# EAGLE design N64TinyUSB_HelveTiny_1.0 (EAGLE 7.7.0)

## Sheet 1 of 2
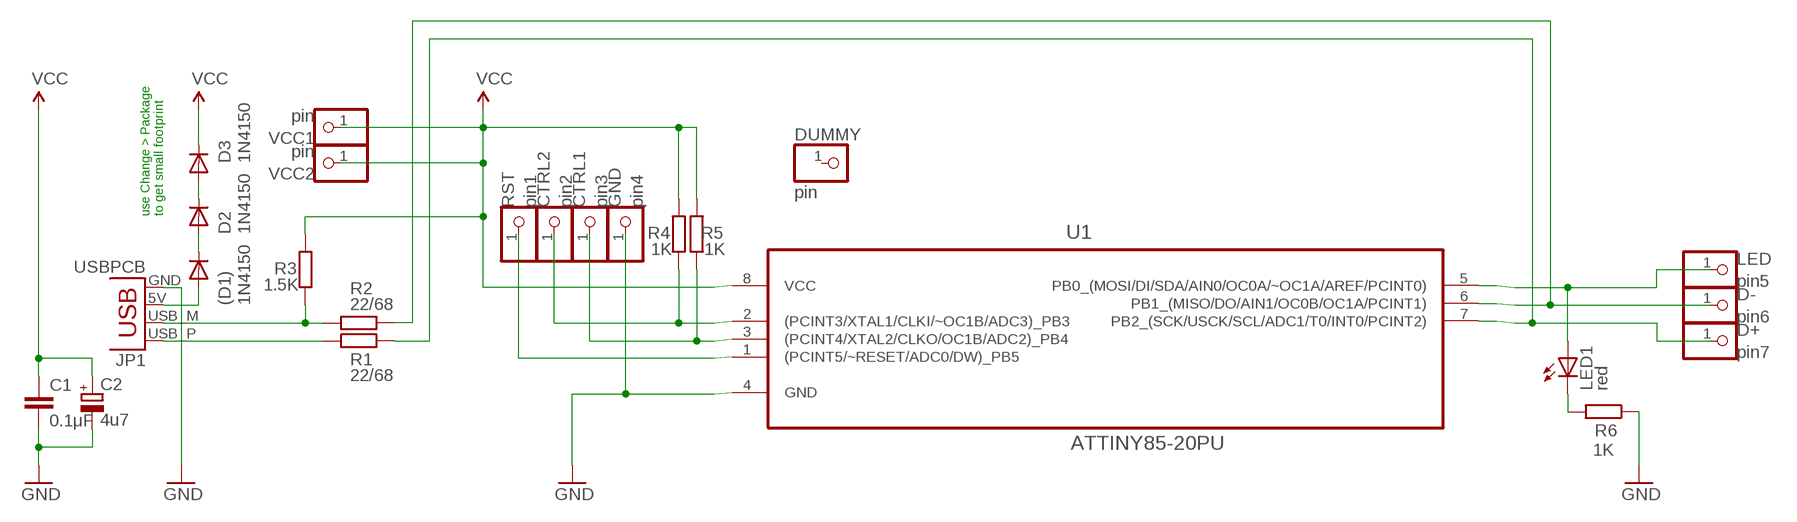
[diagram p0: schematic, sheet 1]

### Parts
(D1)  1N4150  DIODE-D-2.5  [D-2.5]
C1  0.1μF  C-EU025-024X044  [C025-024X044]
C2  4u7  CPOL-EUE2,5-6E  [E2,5-6E]
CTRL1  pin3  PINHD-1X1  [1X01]
CTRL2  pin2  PINHD-1X1  [1X01]
D2  1N4150  DIODE-D-2.5  [D-2.5]
D3  1N4150  DIODE-D-2.5  [D-2.5]
D+  pin7  PINHD-1X1  [1X01]
D-  pin6  PINHD-1X1  [1X01]
DUMMY  pin  PINHD-1X1  [1X01]
GND  pin4  PINHD-1X1  [1X01]
JP1  USBPCB  [USB-A-PCB]
LED  pin5  PINHD-1X1  [1X01]
LED1  red  LED3MM  [LED3MM]
R1  22/68  R-EU_0207/7  [0207/7]
R2  22/68  R-EU_0207/7  [0207/7]
R3  1.5K  R-EU_0207/7  [0207/7]
R4  1K  R-EU_0207/7  [0207/7]
R5  1K  R-EU_0207/7  [0207/7]
R6  1K  R-EU_0207/7  [0207/7]
RST  pin1  PINHD-1X1  [1X01]
U1  ATTINY85-20PU  [DIP254P762X533-8]
VCC1  pin  PINHD-1X1  [1X01]
VCC2  pin  PINHD-1X1  [1X01]

### Nets
CTRL1: CTRL1.1 R5.1 U1.3((PCINT4/XTAL2/CLKO/OC1B/ADC2)_PB4)
CTRL2: CTRL2.1 R4.1 U1.2((PCINT3/XTAL1/CLKI/~OC1B/ADC3)_PB3)
GND: C1.2 C2.- GND.1 JP1.GND R6.1 U1.4(GND)
N$3: JP1.USB_M(D-) R2.1 R3.1
N$4: JP1.USB_P(D+) R1.1
N$6: LED1.A LED.1 U1.5(PB0_(MOSI/DI/SDA/AIN0/OC0A/~OC1A/AREF/PCINT0))
N$7: D-.1 R2.2 U1.6(PB1_(MISO/DO/AIN1/OC0B/OC1A/PCINT1))
N$8: D+.1 R1.2 U1.7(PB2_(SCK/USCK/SCL/ADC1/T0/INT0/PCINT2))
N$9: (D1).A JP1.5V(VBUS)
N$10: (D1).C D2.A
N$11: D2.C D3.A
N$15: LED1.K(C) R6.2
RST: RST.1 U1.1((PCINT5/~RESET/ADC0/DW)_PB5)
VCC: C1.1 C2.+ D3.C R3.2 R4.2 R5.2 U1.8(VCC) VCC1.1 VCC2.1
Unconnected: DUMMY.1

### Notes on the sheet
- use Change > Package
  to get small footprint

## Sheet 2 of 2

## Library data of the parts
(D1) D2 D3 = diode:DIODE-: DIODE
C1 = rcl:C-EU: CAPACITOR, European symbol
C2 = rcl:CPOL-EU: POLARIZED CAPACITOR, European symbol
CTRL1 CTRL2 D+ D- DUMMY GND LED RST VCC1 VCC2 = pinhead:PINHD-1X1: PIN HEADER
JP1 = SparkFun-Connectors:USB: USB Connectors USB-B-PTH is fully proven SKU : PRT-00139/CONN-08278 USB-miniB is fully proven SKU : PRT-00587 USB-A-PCB is untested. USB-A-H is throughly reviewed, but untested. Spark Fun Electronics SKU : PRT-00437 USB-B-SMT is throughly reviewed, but untested. Needs silkscreen touching up. USB-A-S has not been used/tested USB-MB-H has not been used/tested USB-MICROB has been used. CONN-09505
LED1 = led:LED: LED OSRAM: - CHIPLED LG R971, LG N971, LY N971, LG Q971, LY Q971, LO R971, LY R971 LH N974, LH R974 LS Q976, LO Q976, LY Q976 LO Q996 - Hyper CHIPLED LW Q18S LB Q993, LB Q99A, LB R99A - SideLED LS A670, LO A670, LY A670, LG A670, LP A670 LB A673, LV A673, LT A673, LW A673 LH A674 LY A675 LS A676, LA A676, LO A676, LY A676, LW A676 LS A679, LY A679, LG A679 - Hyper Micro SIDELED® LS Y876, LA Y876, LO Y876, LY Y876 LT Y87S - SmartLED LW L88C, LW L88S LB L89C, LB L89S, LG L890 LS L89K, LO L89K, LY L89K LS L896, LA L896, LO L896, LY L896 - TOPLED LS T670, LO T670, LY T670, LG T670, LP T670 LSG T670, LSP T670, LSY T670, LOP T670, LYG T670 LG T671, LOG T671, LSG T671 LB T673, LV T673, LT T673, LW T673 LH T674 LS T676, LA T676, LO T676, LY T676, LB T676, LH T676, LSB T676, LW T676 LB T67C, LV T67C, LT T67C, LS T67K, LO T67K, LY T67K, LW E67C LS E67B, LA E67B, LO E67B, LY E67B, LB E67C, LV E67C, LT E67C LW T67C LS T679, LY T679, LG T679 LS T770, LO T770, LY T770, LG T770, LP T770 LB T773, LV T773, LT T773, LW T773 LH T774 LS E675, LA E675, LY E675, LS T675 LS T776, LA T776, LO T776, LY T776, LB T776 LHGB T686 LT T68C, LB T68C - Hyper Mini TOPLED® LB M676 - Mini TOPLED Santana® LG M470 LS M47K, LO M47K, LY M47K Source: http://www.osram.convergy.de LUXEON: - LUMILED® LXK2-PW12-R00, LXK2-PW12-S00, LXK2-PW14-U00, LXK2-PW14-V00 LXK2-PM12-R00, LXK2-PM12-S00, LXK2-PM14-U00 LXK2-PE12-Q00, LXK2-PE12-R00, LXK2-PE12-S00, LXK2-PE14-T00, LXK2-PE14-U00 LXK2-PB12-K00, LXK2-PB12-L00, LXK2-PB12-M00, LXK2-PB14-N00, LXK2-PB14-P00, LXK2-PB14-Q00 LXK2-PR12-L00, LXK2-PR12-M00, LXK2-PR14-Q00, LXK2-PR14-R00 LXK2-PD12-Q00, LXK2-PD12-R00, LXK2-PD12-S00 LXK2-PH12-R00, LXK2-PH12-S00 LXK2-PL12-P00, LXK2-PL12-Q00, LXK2-PL12-R00 Source: www.luxeon.com KINGBRIGHT: KA-3528ASYC Source: www.kingbright.com
R1-R6 = rcl:R-EU_: RESISTOR, European symbol
U1 = CommonParts:ATTINY85-20PU: 8-bit Microcontroller with In-System Programmable Flash

## Board
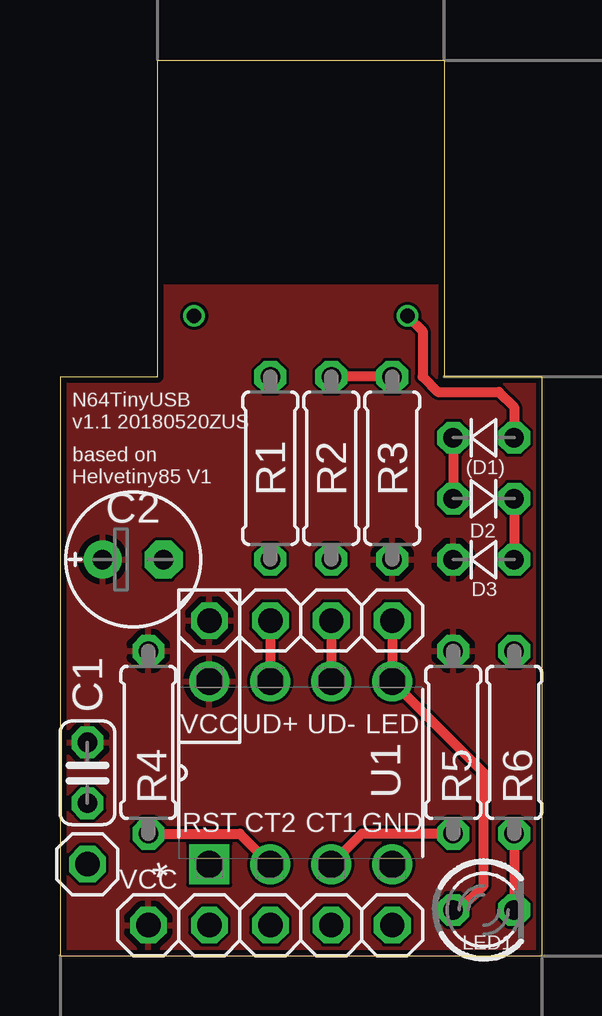
[diagram p1: board, top side]
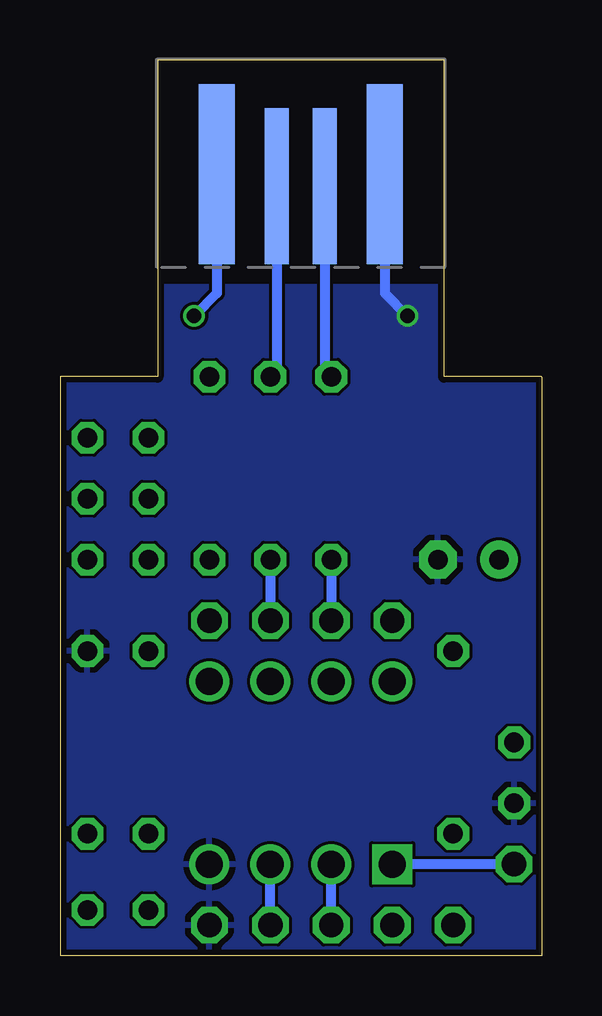
[diagram p2: board, bottom side, seen from below]

Size 20.07 x 37.34 mm. Coordinates in mm from the lower left corner, seen from the top.
Outline: 0,24.12 0,0 20.07,0 20.07,24.13 16,24.13 16,37.34 4.06,37.34 4.06,24.13 0,24.13
Copper layers (1*16): Top 0.035mm / dielectric 1.5mm / Bottom 0.035mm
Design rules "dirt_cheap_dirty_boards.v1": minimum track width 5mil, minimum drill 12mil, track to track 5mil, track to pad 5mil, pad to pad 5mil, via to via 5mil, smd to smd 0mil, copper to edge 10mil, drill to drill 10mil, minimum pad ring 10mil, minimum via ring 6mil, stop-mask expansion 2mil, vias tented up to drill 25mil, thermal gap 10mil

### Footprints (pad centres in the part's own frame; a part is rotated, then mirrored left to right if it is on the bottom)
D-2.5 = drill 0.813 octagon: A 1.27,0; C -1.27,0
C025-024X044 = drill 0.813 octagon: 1 -1.27,0; 2 1.27,0
E2,5-6E = drill 0.813 pad 1.575: + -1.27,0 | drill 0.813 pad 1.575 octagon: - 1.27,0
1X01 = drill 1.016 octagon: 1 0,0
USB-A-PCB = smd 7.5 x 1.5: 5V -0.2,-3.5; GND -0.2,3.5 | smd 6.5 x 1: USB_M 0.3,-1; USB_P 0.3,1
LED3MM = drill 0.813 octagon: A -1.27,0; K 1.27,0
0207/7 = drill 0.813 octagon: 1 -3.81,0; 2 3.81,0
DIP254P762X533-8 = drill 1.118 square: 1 -7.62,7.62 | drill 1.118: 2 -7.62,5.08; 3 -7.62,2.54; 4 -7.62,0; 5 0,0; 6 0,2.54; 7 0,5.08; 8 0,7.62

### Placement (x,y rotation side)
(D1)  17.65,21.59 0 top
C1  1.14,7.62 270 top
C2  3.05,16.51 0 top
CTRL1  11.3,1.27 0 top
CTRL2  8.76,1.27 0 top
D2  17.65,19.05 180 top
D3  17.65,16.51 0 top
D+  8.76,13.97 0 top
D-  11.3,13.97 0 top
DUMMY  6.22,1.27 0 top
GND  13.84,1.27 0 top
JP1  10.03,32.38 270 bottom
LED  13.84,13.97 0 top
LED1  17.65,1.91 0 top
R1  8.76,20.32 270 top
R2  11.3,20.32 270 top
R3  13.84,20.32 270 top
R4  3.68,8.89 90 top
R5  16.38,8.89 90 top
R6  18.92,8.89 270 top
RST  1.14,3.81 0 top
U1  13.84,11.43 90 top
VCC1  6.22,13.97 0 top
VCC2  3.68,1.27 0 top

### Tracks (layer width: path | path; a pad name or v marks a point on that pad's centre or on a via)
CTRL1
  Top 0.406: R5.1 12.57,5.08 U1.3
  Bottom 0.406: CTRL1.1 U1.3
CTRL2
  Top 0.406: R4.1 7.49,5.08 U1.2
  Bottom 0.406: CTRL2.1 U1.2
GND  (via drill 0.6)
  Bottom 0.406: JP1.GND 6.53,27.61 v5.59,26.67
  pour Bottom: 4.32,27.94 15.75,27.94 15.75,24.13 20.07,24.13 20.07,0 0,0 0,24.13 4.32,24.13
N$3
  Top 0.406: R3.1 R2.1
  Bottom 0.406: JP1.USB_M 11.03,24.4 R2.1
N$4
  Bottom 0.406: JP1.USB_P 9.03,24.4 R1.1
N$6
  Top 0.406: LED1.A 16.64,1.91 17.65,2.92 17.65,7.62 U1.5 LED.1
N$7
  Top 0.406: D-.1 U1.6
  Bottom 0.406: R2.2 D-.1
N$8
  Top 0.406: D+.1 U1.7
  Bottom 0.406: R1.2 D+.1
N$9  (via drill 0.6)
  Top 0.406: v14.48,26.67 15.11,26.04 15.11,24.13 15.75,23.5 18.29,23.5 18.92,22.86 (D1).A
  Bottom 0.406: JP1.5V 13.53,27.61 v14.48,26.67
N$10
  Top 0.406: (D1).C D2.A
N$11
  Top 0.406: D2.C D3.A
N$15
  Top 0.406: R6.2 LED1.K
RST
  Bottom 0.406: RST.1 U1.1
VCC
  pour Top: 4.32,27.94 15.75,27.94 15.75,24.13 20.07,24.13 20.07,0 0,0 0,24.13 4.32,24.13

### Text on the board
tNames: N64TinyUSB / v1.1 20180520ZUS | based on / Helvetiny85 V1 | VCC | UD+ | UD- | LED | RST | CT2 | CT1 | GND | VCC